# Altium schematic sheet IMX6DL_POWER.SchDoc
size B
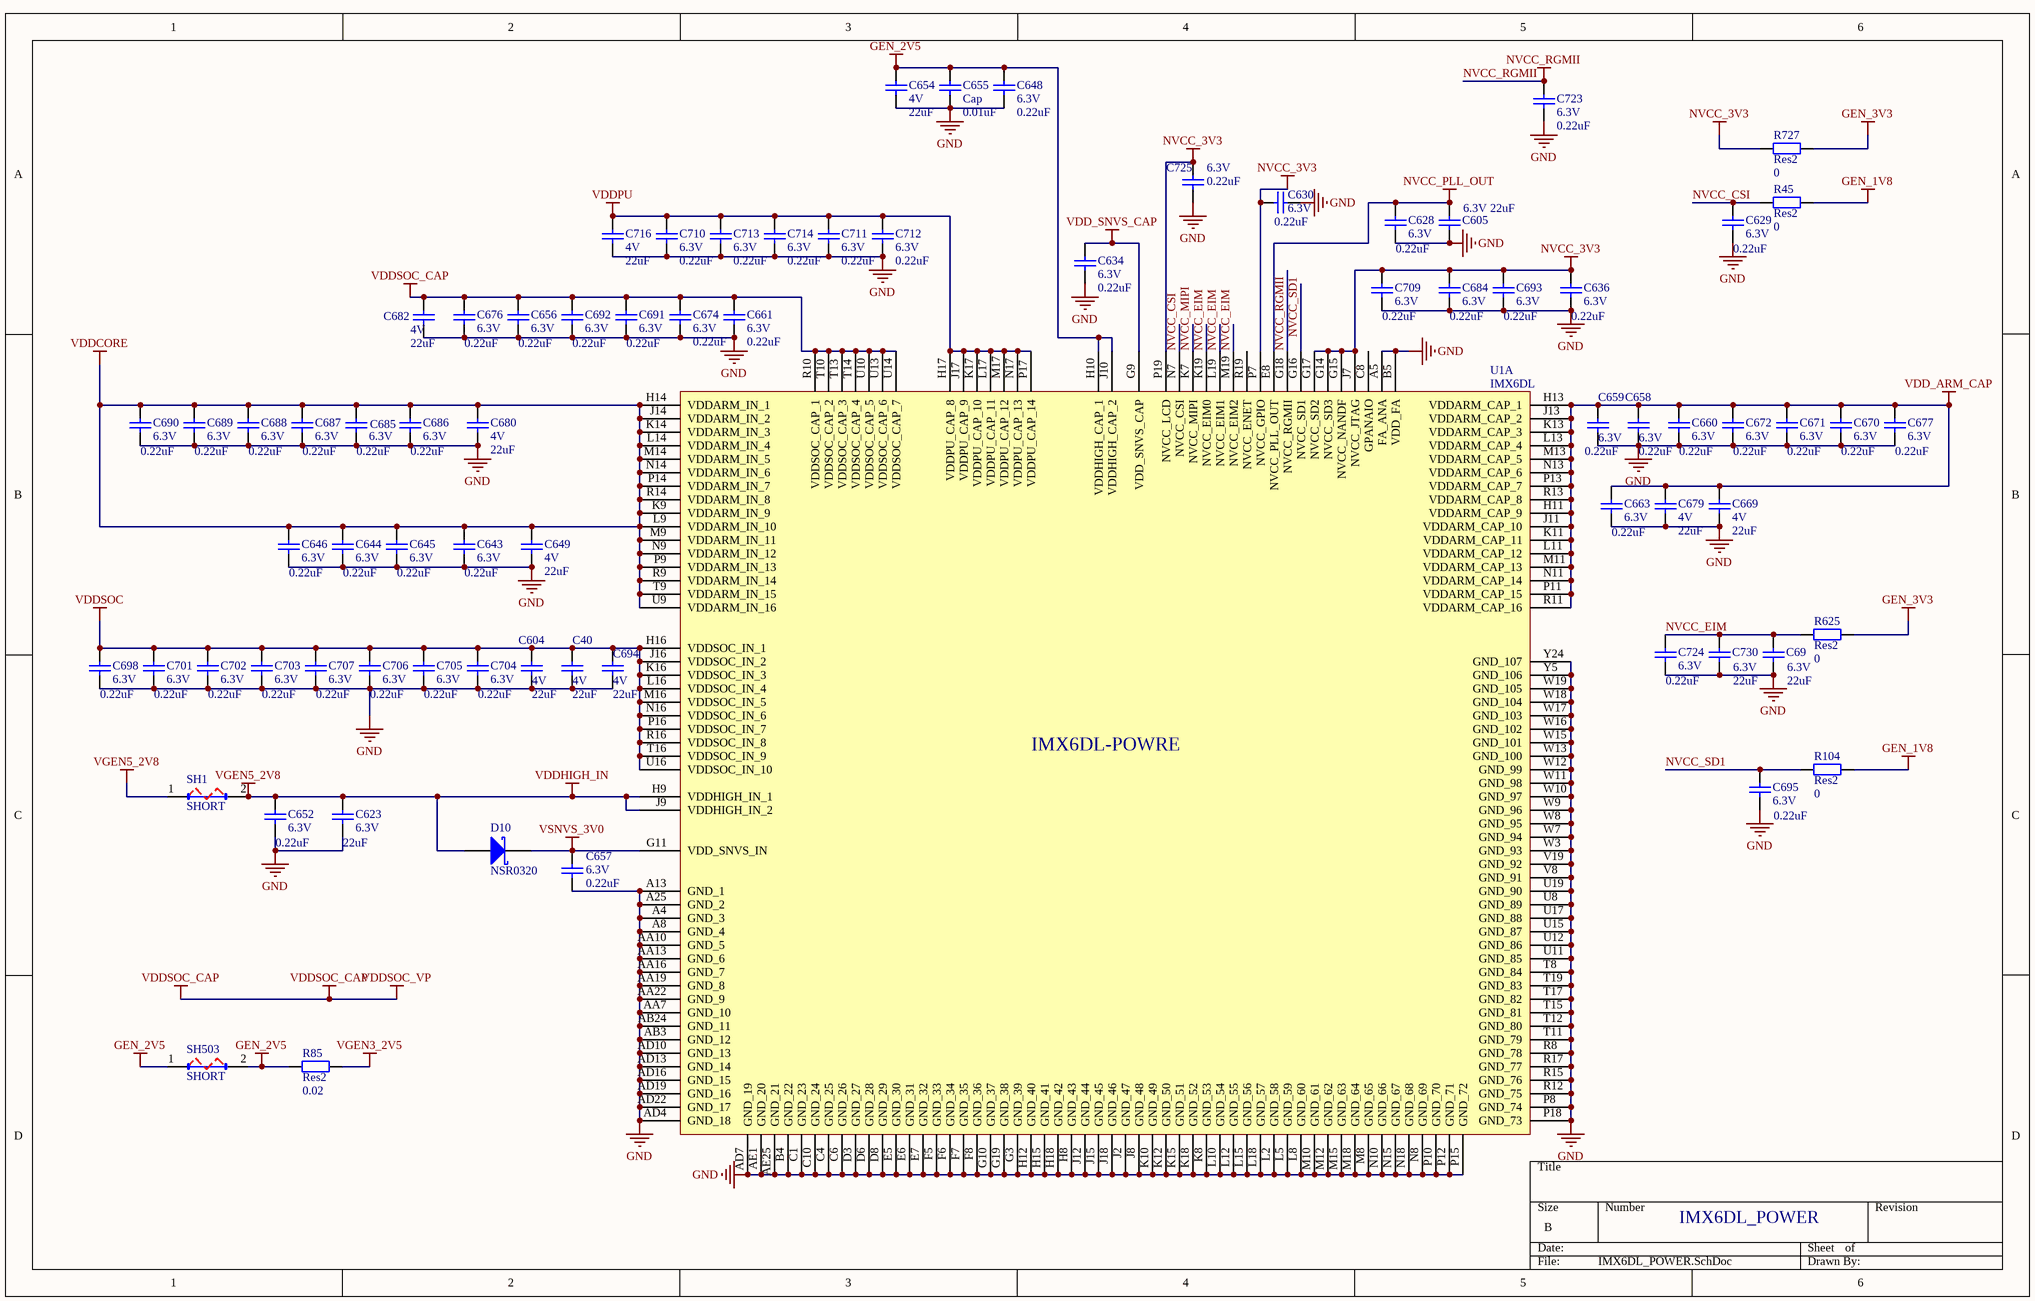
[diagram p0: IMX6DL_POWER.SchDoc]

## Parts
C40  4V  value 22uF  [0603]
C69  6.3V  value 22uF  [0603]
C604  4V  value 22uF  [0603]
C605  6.3V  value 22uF  [0603]
C623  6.3V  value 22uF  [0603]
C628  6.3V  value 0.22uF  [0201]
C629  6.3V  value 0.22uF  [0201]
C630  6.3V  value 0.22uF  [0201]
C634  6.3V  value 0.22uF  [0201]
C636  6.3V  value 0.22uF  [0201]
C643  6.3V  value 0.22uF  [0201]
C644  6.3V  value 0.22uF  [0201]
C645  6.3V  value 0.22uF  [0201]
C646  6.3V  value 0.22uF  [0201]
C648  6.3V  value 0.22uF  [0201]
C649  4V  value 22uF  [0603]
C652  6.3V  value 0.22uF  [0201]
C654  4V  value 22uF  [0603]
C655  Cap  value 0.01uF  [0201]
C656  6.3V  value 0.22uF  [0201]
C657  6.3V  value 0.22uF  [0201]
C658  6.3V  value 0.22uF  [0201]
C659  6.3V  value 0.22uF  [0201]
C660  6.3V  value 0.22uF  [0201]
C661  6.3V  value 0.22uF  [0201]
C663  6.3V  value 0.22uF  [0201]
C669  4V  value 22uF  [0603]
C670  6.3V  value 0.22uF  [0201]
C671  6.3V  value 0.22uF  [0201]
C672  6.3V  value 0.22uF  [0201]
C674  6.3V  value 0.22uF  [0201]
C676  6.3V  value 0.22uF  [0201]
C677  6.3V  value 0.22uF  [0201]
C679  4V  value 22uF  [0603]
C680  4V  value 22uF  [0603]
C682  4V  value 22uF  [0603]
C684  6.3V  value 0.22uF  [0201]
C685  6.3V  value 0.22uF  [0201]
C686  6.3V  value 0.22uF  [0201]
C687  6.3V  value 0.22uF  [0201]
C688  6.3V  value 0.22uF  [0201]
C689  6.3V  value 0.22uF  [0201]
C690  6.3V  value 0.22uF  [0201]
C691  6.3V  value 0.22uF  [0201]
C692  6.3V  value 0.22uF  [0201]
C693  6.3V  value 0.22uF  [0201]
C694  4V  value 22uF  [0603]
C695  6.3V  value 0.22uF  [0201]
C698  6.3V  value 0.22uF  [0201]
C701  6.3V  value 0.22uF  [0201]
C702  6.3V  value 0.22uF  [0201]
C703  6.3V  value 0.22uF  [0201]
C704  6.3V  value 0.22uF  [0201]
C705  6.3V  value 0.22uF  [0201]
C706  6.3V  value 0.22uF  [0201]
C707  6.3V  value 0.22uF  [0201]
C709  6.3V  value 0.22uF  [0201]
C710  6.3V  value 0.22uF  [0201]
C711  6.3V  value 0.22uF  [0201]
C712  6.3V  value 0.22uF  [0201]
C713  6.3V  value 0.22uF  [0201]
C714  6.3V  value 0.22uF  [0201]
C716  4V  value 22uF  [0603]
C723  6.3V  value 0.22uF  [0201]
C724  6.3V  value 0.22uF  [0201]
C725  6.3V  value 0.22uF  [0201]
C730  6.3V  value 22uF  [0603]
D10  NSR0320  [NSR0320MW2T1G-SOD323]
R45  Res2  value 0  [0402]
R85  Res2  value 0.02  [0805]
R104  Res2  value 0  [0402]
R625  Res2  value 0  [0402]
R727  Res2  value 0  [0402]
SH1  SHORT  [SHORT_SH]
SH503  SHORT  [SHORT_SH]
U1  IMX6DL  [IMX6DL-BGA624x25]  (part A of 8)

## Nets
GEN_1V8: R45.2 R104.2
GEN_2V5: C648.2 C654.1 C655.2 R85.1 SH503.1(VCCIO) SH503.2(VCCIO) U1.H10(VDDHIGH_CAP_1) U1.J10(VDDHIGH_CAP_2)
GEN_3V3: R625.2 R727.2
GND: C40.1 C69.2 C604.1 C605.2 C623.1 C628.1 C629.1 C630.2 C634.2 C636.1 C643.1 C644.1 C645.1 C646.1 C648.1 C649.1 C652.1 C654.2 C655.1 C656.1 C657.1 C658.1 C659.1 C660.1 C661.1 C663.1 C669.1 C670.1 C671.1 C672.1 C674.1 C676.1 C677.1 C679.1 C680.1 C682.1 C684.1 C685.1 C686.1 C687.1 C688.1 C689.1 C690.1 C691.1 C692.1 C693.1 C694.1 C695.1 C698.1 C701.1 C702.1 C703.1 C704.1 C705.1 C706.1 C707.1 C709.1 C710.1 C711.1 C712.1 C713.1 C714.1 C716.1 C723.2 C724.1 C725.2 C730.2 U1.A4(GND_3) U1.A5(FA_ANA) U1.A8(GND_4) U1.A13(GND_1) U1.A25(GND_2) U1.AA7(GND_10) U1.AA10(GND_5) U1.AA13(GND_6) U1.AA16(GND_7) U1.AA19(GND_8) U1.AA22(GND_9) U1.AB3(GND_12) U1.AB24(GND_11) U1.AD4(GND_18) U1.AD7(GND_19) U1.AD10(GND_13) U1.AD13(GND_14) U1.AD16(GND_15) U1.AD19(GND_16) U1.AD22(GND_17) U1.AE1(GND_20) U1.AE25(GND_21) U1.B4(GND_22) U1.B5(VDD_FA) U1.C1(GND_23) U1.C4(GND_25) U1.C6(GND_26) U1.C10(GND_24) U1.D3(GND_27) U1.D6(GND_28) U1.D8(GND_29) U1.E5(GND_30) U1.E6(GND_31) U1.E7(GND_32) U1.F5(GND_33) U1.F6(GND_34) U1.F7(GND_35) U1.F8(GND_36) U1.G3(GND_39) U1.G10(GND_37) U1.G19(GND_38) U1.H8(GND_43) U1.H12(GND_40) U1.H15(GND_41) U1.H18(GND_42) U1.J2(GND_47) U1.J8(GND_48) U1.J12(GND_44) U1.J15(GND_45) U1.J18(GND_46) U1.K8(GND_53) U1.K10(GND_49) U1.K12(GND_50) U1.K15(GND_51) U1.K18(GND_52) U1.L2(GND_58) U1.L5(GND_59) U1.L8(GND_60) U1.L10(GND_54) U1.L12(GND_55) U1.L15(GND_56) U1.L18(GND_57) U1.M8(GND_65) U1.M10(GND_61) U1.M12(GND_62) U1.M15(GND_63) U1.M18(GND_64) U1.N8(GND_69) U1.N10(GND_66) U1.N15(GND_67) U1.N18(GND_68) U1.P8(GND_74) U1.P10(GND_70) U1.P12(GND_71) U1.P15(GND_72) U1.P18(GND_73) U1.R8(GND_78) U1.R12(GND_75) U1.R15(GND_76) U1.R17(GND_77) U1.T8(GND_84) U1.T11(GND_79) U1.T12(GND_80) U1.T15(GND_81) U1.T17(GND_82) U1.T19(GND_83) U1.U8(GND_89) U1.U11(GND_85) U1.U12(GND_86) U1.U15(GND_87) U1.U17(GND_88) U1.U19(GND_90) U1.V8(GND_91) U1.V19(GND_92) U1.W3(GND_93) U1.W7(GND_94) U1.W8(GND_95) U1.W9(GND_96) U1.W10(GND_97) U1.W11(GND_98) U1.W12(GND_99) U1.W13(GND_100) U1.W15(GND_101) U1.W16(GND_102) U1.W17(GND_103) U1.W18(GND_104) U1.W19(GND_105) U1.Y5(GND_106) U1.Y24(GND_107)
NVCC_3V3: C630.1 C636.2 C684.2 C693.2 C709.2 C725.1 R727.1 U1.G14(NVCC_SD3) U1.G15(NVCC_NANDF) U1.G17(NVCC_SD2) U1.J7(NVCC_JTAG) U1.P7(NVCC_GPIO) U1.P19(NVCC_LCD)
NVCC_PLL_OUT: C605.1 C628.2 U1.E8(NVCC_PLL_OUT)
NVCC_RGMII: C723.1 U1.G18(NVCC_RGMII)
VDD_ARM_CAP: C658.2 C659.2 C660.2 C663.2 C669.2 C670.2 C671.2 C672.2 C677.2 C679.2 U1.H11(VDDARM_CAP_9) U1.H13(VDDARM_CAP_1) U1.J11(VDDARM_CAP_10) U1.J13(VDDARM_CAP_2) U1.K11(VDDARM_CAP_11) U1.K13(VDDARM_CAP_3) U1.L11(VDDARM_CAP_12) U1.L13(VDDARM_CAP_4) U1.M11(VDDARM_CAP_13) U1.M13(VDDARM_CAP_5) U1.N11(VDDARM_CAP_14) U1.N13(VDDARM_CAP_6) U1.P11(VDDARM_CAP_15) U1.P13(VDDARM_CAP_7) U1.R11(VDDARM_CAP_16) U1.R13(VDDARM_CAP_8)
VDD_SNVS_CAP: C634.1 U1.G9(VDD_SNVS_CAP)
VDDCORE: C643.2 C644.2 C645.2 C646.2 C649.2 C680.2 C685.2 C686.2 C687.2 C688.2 C689.2 C690.2 U1.H14(VDDARM_IN_1) U1.J14(VDDARM_IN_2) U1.K9(VDDARM_IN_9) U1.K14(VDDARM_IN_3) U1.L9(VDDARM_IN_10) U1.L14(VDDARM_IN_4) U1.M9(VDDARM_IN_11) U1.M14(VDDARM_IN_5) U1.N9(VDDARM_IN_12) U1.N14(VDDARM_IN_6) U1.P9(VDDARM_IN_13) U1.P14(VDDARM_IN_7) U1.R9(VDDARM_IN_14) U1.R14(VDDARM_IN_8) U1.T9(VDDARM_IN_15) U1.U9(VDDARM_IN_16)
VDDHIGH_IN: C623.2 C652.2 D10.1(A) SH1.1(VCCIO) SH1.2(VCCIO) U1.H9(VDDHIGH_IN_1) U1.J9(VDDHIGH_IN_2)  [also labelled VGEN5_2V8]
VDDPU: C710.2 C711.2 C712.2 C713.2 C714.2 C716.2 U1.H17(VDDPU_CAP_8) U1.J17(VDDPU_CAP_9) U1.K17(VDDPU_CAP_10) U1.L17(VDDPU_CAP_11) U1.M17(VDDPU_CAP_12) U1.N17(VDDPU_CAP_13) U1.P17(VDDPU_CAP_14)
VDDSOC: C40.2 C604.2 C694.2 C698.2 C701.2 C702.2 C703.2 C704.2 C705.2 C706.2 C707.2 U1.H16(VDDSOC_IN_1) U1.J16(VDDSOC_IN_2) U1.K16(VDDSOC_IN_3) U1.L16(VDDSOC_IN_4) U1.M16(VDDSOC_IN_5) U1.N16(VDDSOC_IN_6) U1.P16(VDDSOC_IN_7) U1.R16(VDDSOC_IN_8) U1.T16(VDDSOC_IN_9) U1.U16(VDDSOC_IN_10)
VDDSOC_CAP: C656.2 C661.2 C674.2 C676.2 C682.2 C691.2 C692.2 U1.R10(VDDSOC_CAP_1) U1.T10(VDDSOC_CAP_2) U1.T13(VDDSOC_CAP_3) U1.T14(VDDSOC_CAP_4) U1.U10(VDDSOC_CAP_5) U1.U13(VDDSOC_CAP_6) U1.U14(VDDSOC_CAP_7)  [also labelled VDDSOC_VP]
VGEN3_2V5: R85.2
VSNVS_3V0: C657.2 D10.2(C) U1.G11(VDD_SNVS_IN)
NVCC_CSI: C629.2 R45.1 U1.N7(NVCC_CSI)
NVCC_EIM: C69.1 C724.2 C730.1 R625.1 U1.K19(NVCC_EIM0) U1.L19(NVCC_EIM1) U1.M19(NVCC_EIM2)
NVCC_MIPI: U1.K7(NVCC_MIPI)
NVCC_SD1: C695.2 R104.1 U1.G16(NVCC_SD1)

Not connected (* = marked no-connect by the designer): U1 C8(GPANAIO) R19(NVCC_ENET)

## Notes on the sheet
- IMX6DL_POWER
- (in symbol IMX6DL, part A) IMX6DL-POWRE

## Library data of the parts
C40 C69 C604 C605 C623 C628-C630 C634 C636 C643-C646 C648 C649 C652 C654-C661 C663 C669-C672 C674 C676 C677 C679 C680 C682 C684-C695 C698 C701-C707 C709-C714 C716 C723-C725 C730 = Cap: Capacitor; Published: 8-Jun-2000; LatestRevisionDate: 17-Jul-2002; LatestRevisionNote: Re-released for DXP Platform.; PackageReference: RAD-0.3; Publisher: Altium Limited
R45 R85 R104 R625 R727 = Res2: Resistor; Published: 8-Jun-2000; LatestRevisionDate: 17-Jul-2002; LatestRevisionNote: Re-released for DXP Platform.; PackageReference: AXIAL-0.4; Publisher: Altium Limited
SH1 SH503 = SOLDER SHORT